# EasyEDA Pro project Pressure_Plate_PCB.eprj

# Schematic Schematic1
Board Name: V1.0; Create Date: 2025-04-03; Page Name: P1; Project Name: Pressure_Plate_PCB; Schematic Name: Schematic1; Update Date: 2025-06-12; Company: EasyEDA.com; Drawn: EasyEDA; Page Size: A4; Part Number: JLCPCB-002; Reviewed: EasyEDA; Version: V0.1
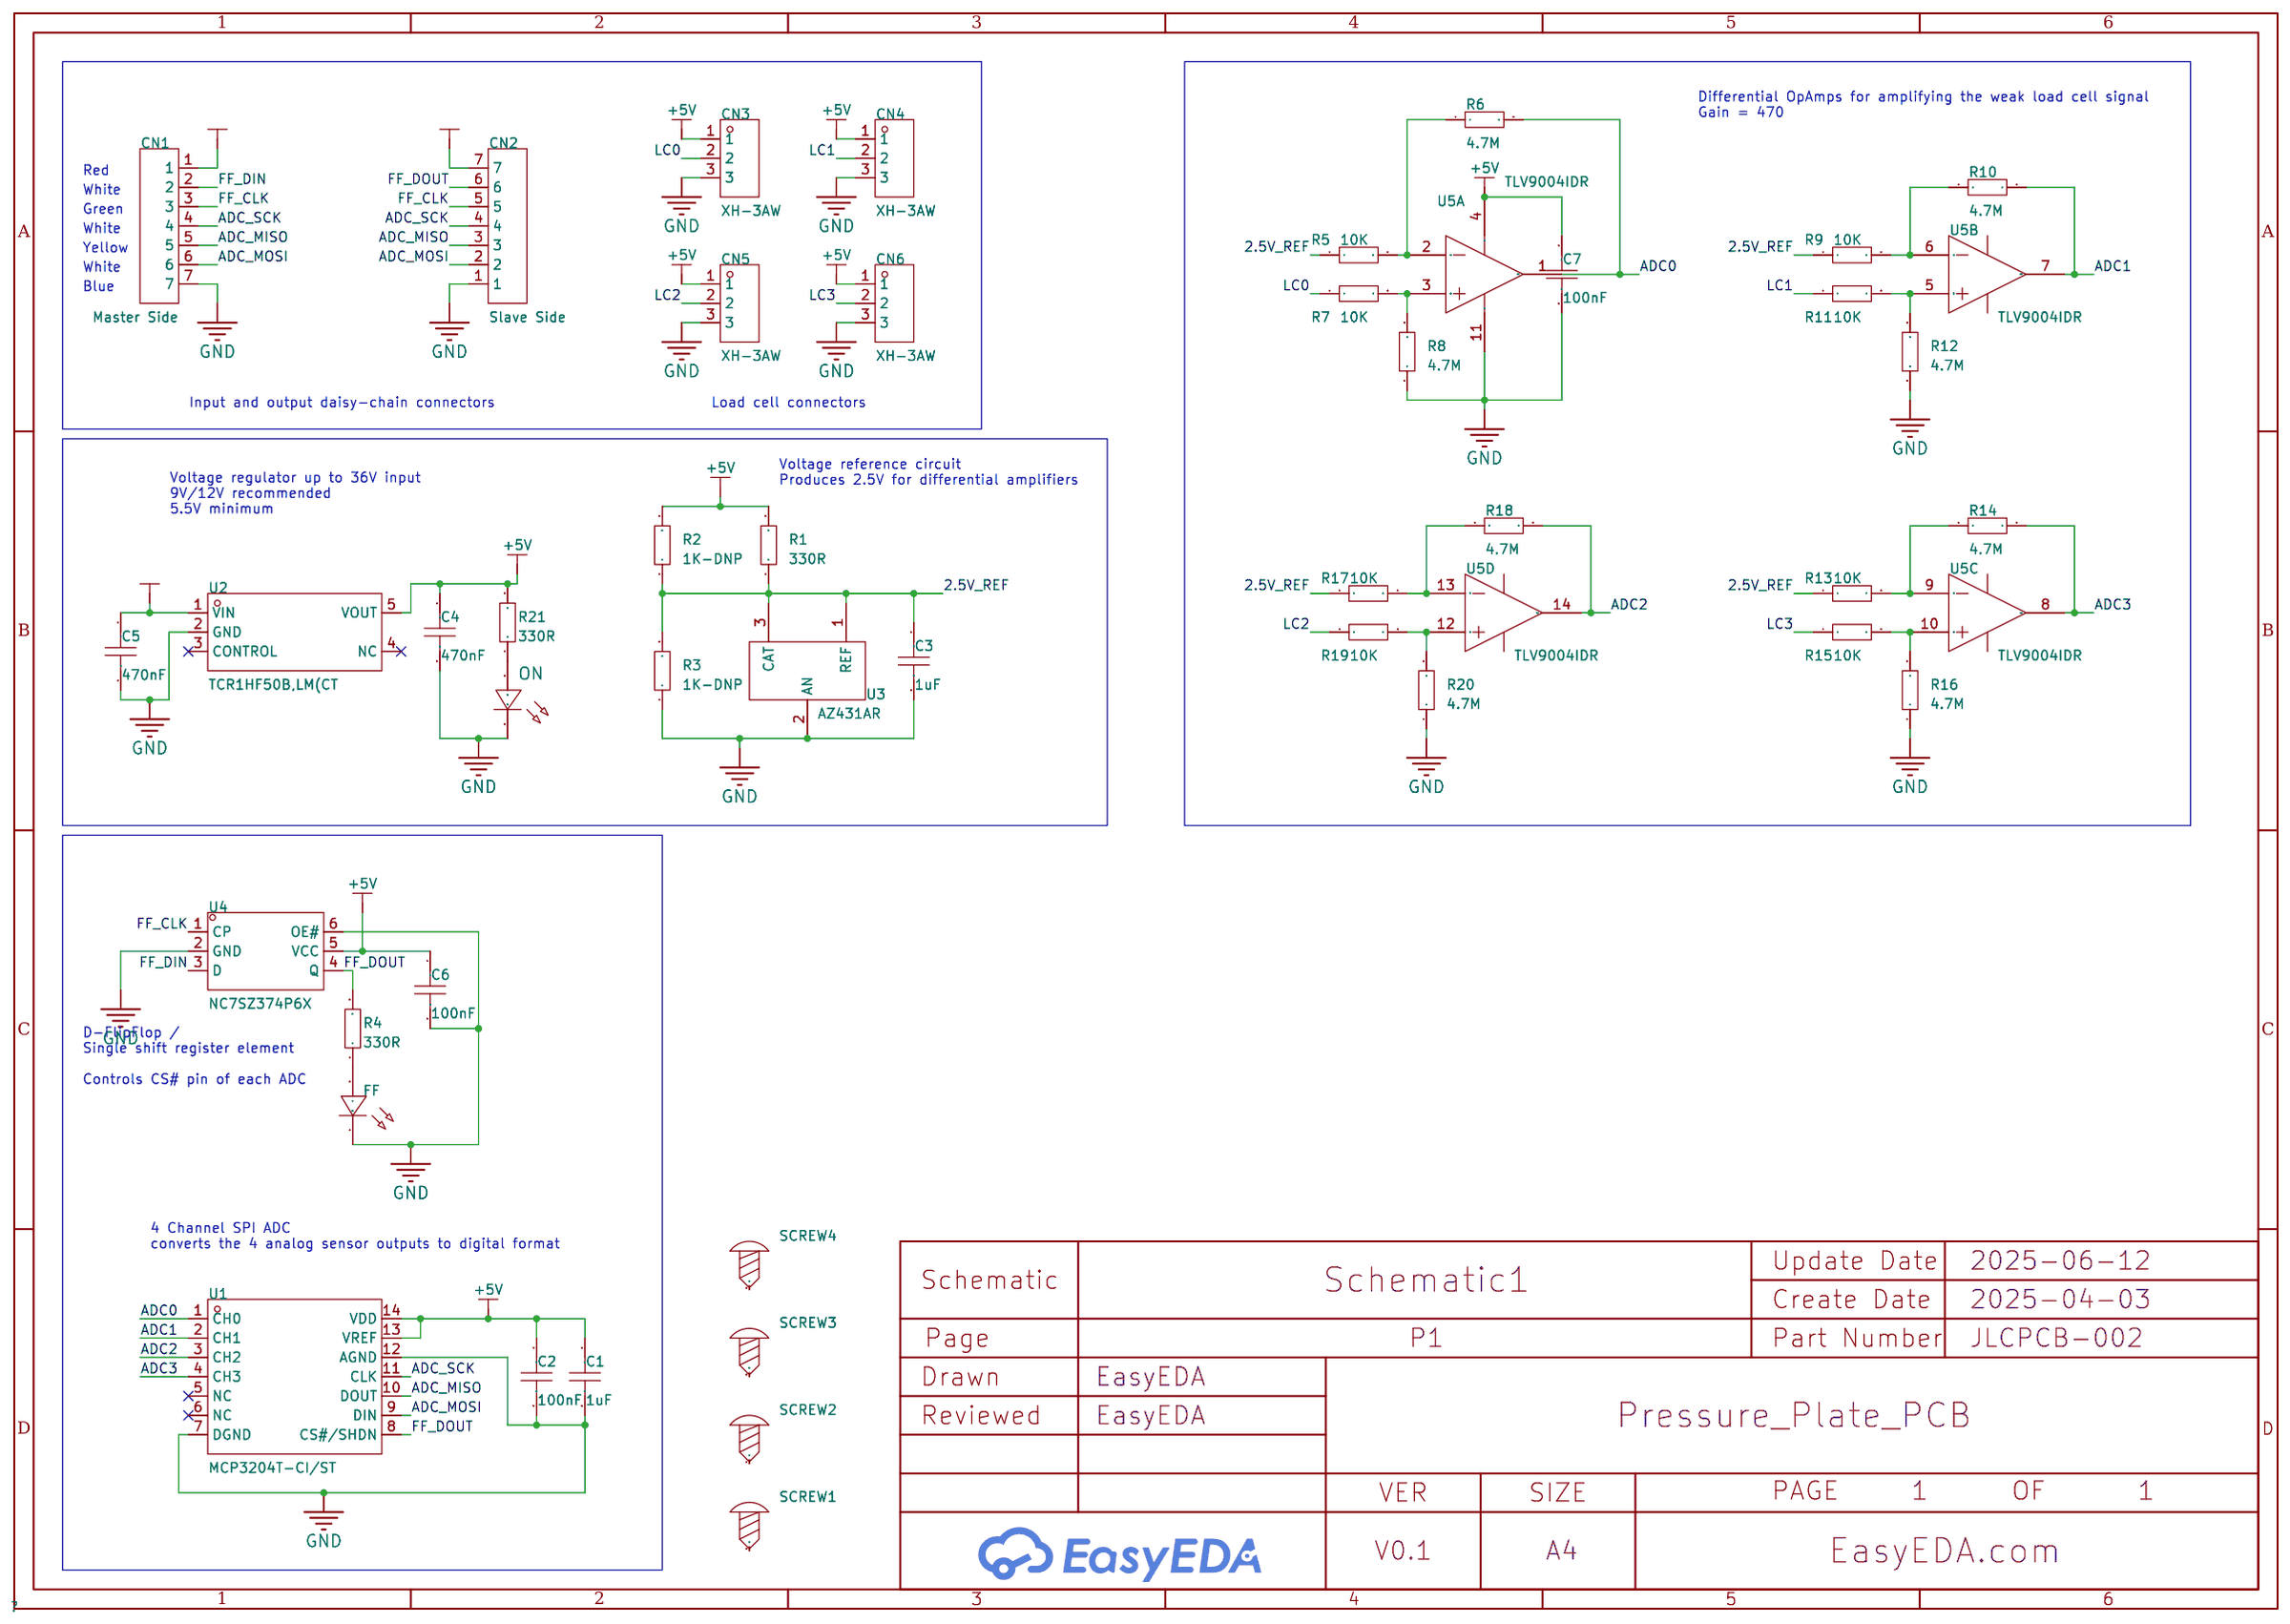
[diagram p0: schematic sheet]

## Parts
C1  1uF  [C0603]
C2  100nF  [C0603]
C3  1uF  [C0603]
C4  470nF  [C0603]
C5  470nF  [C0603]
C6  100nF  [C0603]
C7  100nF  [C0603]
CN1  Master Side  [CONN-TH_7P-P2.50_DEALON_XH-W-7A]
CN2  Slave Side  [CONN-TH_7P-P2.50_DEALON_XH-W-7A]
CN3  XH-3AW  [CONN-TH_3P-P2.50_XH-3A]
CN4  XH-3AW  [CONN-TH_3P-P2.50_XH-3A]
CN5  XH-3AW  [CONN-TH_3P-P2.50_XH-3A]
CN6  XH-3AW  [CONN-TH_3P-P2.50_XH-3A]
FF  -  [LED0603-RD_GREEN]
ON  -  [LED0603-R-RD]
R1  330R  [R0603]
R2  1K-DNP  [R0603]
R3  1K-DNP  [R0603]
R4  330R  [R0603]
R5  10K  [R0603]
R6  4.7M  [R0603]
R7  10K  [R0603]
R8  4.7M  [R0603]
R9  10K  [R0603]
R10  4.7M  [R0603]
R11  10K  [R0603]
R12  4.7M  [R0603]
R13  10K  [R0603]
R14  4.7M  [R0603]
R15  10K  [R0603]
R16  4.7M  [R0603]
R17  10K  [R0603]
R18  4.7M  [R0603]
R19  10K  [R0603]
R20  4.7M  [R0603]
R21  330R  [R0603]
SCREW1  -  [Screw-Hole-M4]
SCREW2  -  [Screw-Hole-M4]
SCREW3  -  [Screw-Hole-M4]
SCREW4  -  [Screw-Hole-M4]
U1  MCP3204T-CI/ST  [TSSOP-14_L5.0-W4.4-P0.65-LS6.4-BL]
U2  TCR1HF50B,LM(CT  [SOT-25-5_L2.9-W1.6-P0.95-LS2.8-BR]
U3  AZ431AR  [SOT-89-3_L4.5-W2.5-P1.50-LS4.2-BR]
U4  NC7SZ374P6X  [SC-70-6_L2.2-W1.3-P0.65-LS2.2-BR]
U5  TLV9004IDR  [SOIC-14_L8.7-W3.9-P1.27-LS6.0-BL]  (sections 1,2,3,4)

## Library data of the parts
C1-C7 = CAP_0603: Supplier Footprint: 0603
CN1 CN2 = XH-W-7A: LCSC Part Name: 1x7P 间距:2.5mm 弯插 系列:XH; Supplier Part: C5160924; Manufacturer: DEALON(德艺隆); Supplier Footprint: 弯插,P=2.5mm; JLCPCB Part Class: Extended Part; Datasheet: https://atta.szlcsc.com/upload/public/pdf/source/20220914/CF0CFD58EB788AE96CD22F6B3F88CF6E.pdf; Supplier: LCSC; Pins Structure: 1x7P; Pitch: 2.5mm; Mounting Type: Bend-in; Reference Series: XH; Number of Pins: 7P; Number of Rows: 1; Number of PINs Per Row: 7; Current Rating: 3A; Operating Temperature: -25℃~+85℃; Voltage Rating: 250V; Color: White
CN3-CN6 = XH-3AW_C18428: LCSC Part Name: 系列:XH 间距:2.5mm 1x3P; Supplier Part: C18428; Manufacturer: BOOMELE(博穆精密); Supplier Footprint: 弯插,P=2.5mm; JLCPCB Part Class: Extended Part; Datasheet: https://atta.szlcsc.com/upload/public/pdf/source/20151222/1457707654251.pdf; Supplier: LCSC; Pins Structure: 1x3P; Pitch: 2.5mm; Mounting Style: Right-Angle; Reference Series: XH; Number of Pins: 3P; Number of Rows: 1; Number of PINs Per Row: 3
FF = LED_0603-G
ON = LED_0603-R: Supplier Footprint: 0603
R1-R21 = Res_0603: Supplier Footprint: 0603
SCREW1-SCREW4 = Screw-Hole-M4: Supplier Footprint: 插件
U1 = MCP3204T-CI/ST: Supplier Part: C627070; Manufacturer: MICROCHIP(美国微芯); Supplier Footprint: TSSOP-14; JLCPCB Part Class: Extended Part; Datasheet: https://atta.szlcsc.com/upload/public/pdf/source/20140724/1457707162058.pdf; Supplier: LCSC; resolution: 12 Bits; sampling frequency: 100kHz; number of channels: 4; Supply Voltage: 2.7V~5.5V; Interface: SPI; differential input: Yes; Operating Temperature: -40℃~+85℃
U2 = TCR1HF50B,LM(CT: Supplier Part: C22041565; Manufacturer: TOSHIBA(东芝); Supplier: LCSC
U3 = AZ431AR-ATRE1: Supplier Part: C112173; Manufacturer: DIODES(美台); Supplier Footprint: SOT-89-3; JLCPCB Part Class: Extended Part; Datasheet: https://atta.szlcsc.com/upload/public/pdf/source/20170912/C112173_1505207743875963371.pdf; Supplier: LCSC; Output Type: Adjustable; Output Voltage: 2.5V~36V; Output Current: 100mA; Tolerance: ±0.4%; Temperature Coefficient: 20ppm/℃; Reference Type: parallel connection; Minimum Cathode Current for Regulation: 1mA; Operating Temperature: -40℃~+125℃@(Ta)
U4 = NC7SZ374P6X: Supplier Part: C232790; Manufacturer: onsemi(安森美); Supplier Footprint: SC-70-6; JLCPCB Part Class: Extended Part; Datasheet: https://atta.szlcsc.com/upload/public/pdf/source/20181222/C232790_987FEFE174370B77905B688237A9CDF8.pdf; Supplier: LCSC; Type: D-Type; Trigger Type: Rising Edge; Supply Voltage: 1.65V~5.5V; Clock Frequency: 175MHz; Function: Standard; Number of Elements: 1; Number of Bits per Element: 1; Maximum Propagation Delay: 4ns@5V,50pF; Series: 7SZSeries; Sink Current: 32mA; Source Current: 32mA; Quiescent Current (Iq): 1uA; Input Capacitance: 3pF; Operating Temperature: -40℃~+85℃
U5 = TLV9004IDR: Supplier Part: C2058000; Manufacturer: TI(德州仪器); Supplier Footprint: SOIC-14; JLCPCB Part Class: Extended Part; Datasheet: https://www.ti.com/cn/lit/gpn/tlv9004; Supplier: LCSC; Number of Circuits: Four channels; Gain Bandwidth Product(GBP): 1MHz; Slew Rate(SR): 2V/us; Current - Input Bias(Ib): 5pA; Output Current: 40mA; Operating Temperature: -40℃~+125℃

## Nets
2.5V_REF: C3.1 R1.1 R2.1 R3.2 R5.1 R9.1 R13.1 R17.1 U3.1(REF) U3.3(CAT)
+5V: C1.1 C2.1 C4.1 C6.1 C7.1 CN3.1 CN4.1 CN5.1 CN6.1 R1.2 R2.2 R21.2 U1.13(VREF) U1.14(VDD) U2.5(VOUT) U4.5(VCC) U5.4(V+)
GND: C1.2 C2.2 C3.2 C4.2 C5.2 C6.2 C7.2 CN1.7 CN2.1 CN3.3 CN4.3 CN5.3 CN6.3 FF.1(C) ON.2(C) R3.1 R8.1 R12.1 R16.1 R20.1 U1.7(DGND) U1.12(AGND) U2.2(GND) U3.2(AN) U4.2(GND) U4.6(OE#) U5.11(V-)
VCC: C5.1 CN1.1 CN2.7 U2.1(VIN)
ADC0: R6.2 U1.1(CH0) U5.1(OUT1)
ADC1: R10.2 U1.2(CH1) U5.7(OUT2)
ADC2: R18.2 U1.3(CH2) U5.14(OUT4)
ADC3: R14.2 U1.4(CH3) U5.8(OUT3)
ADC_MISO: CN1.5 CN2.3 U1.10(DOUT)
ADC_MOSI: CN1.6 CN2.2 U1.9(DIN)
ADC_SCK: CN1.4 CN2.4 U1.11(CLK)
FF_CLK: CN1.3 CN2.5 U4.1(CP)
FF_DIN: CN1.2 U4.3(D)
FF_DOUT: CN2.6 R4.2 U1.8(CS#/SHDN) U4.4(Q)
LC0: CN3.2 R7.1
LC1: CN4.2 R11.1
LC2: CN5.2 R19.1
LC3: CN6.2 R15.1
$1N2374: FF.2(A) R4.1
$1N2890: R7.2 R8.2 U5.3(IN1+)
$1N2902: R5.2 R6.1 U5.2(IN1-)
$1N3068: R11.2 R12.2 U5.5(IN2+)
$1N3071: R9.2 R10.1 U5.6(IN2-)
$1N3198: R15.2 R16.2 U5.10(IN3+)
$1N3201: R13.2 R14.1 U5.9(IN3-)
$1N3455: R19.2 R20.2 U5.12(IN4+)
$1N3458: R17.2 R18.1 U5.13(IN4-)
$1N3772: ON.1(A) R21.1

Not connected (* = marked no-connect by the designer): SCREW1 1; SCREW2 1; SCREW3 1; SCREW4 1; U1 5(NC)* 6(NC)*; U2 3(CONTROL)* 4(NC)*

## Notes on the sheet
- Differential OpAmps for amplifying the weak load cell signal
  Gain = 470
- Red
- White
- Green
- White
- White
- Yellow
- Blue
- Input and output daisy-chain connectors
- Load cell connectors
- Voltage reference circuit
  Produces 2.5V for differential amplifiers
- Voltage regulator up to 36V input
  9V/12V recommended
  5.5V minimum
- D-FlipFlop /
  Single shift register element
  Controls CS# pin of each ADC
- 4 Channel SPI ADC
  converts the 4 analog sensor outputs to digital format

# Schematic Schematic1_1
Board Name: V1.0_SOIC14; Create Date: 2025-05-13; Page Name: P1; Project Name: Pressure_Plate_PCB; Schematic Name: Schematic1_1; Update Date: 2025-05-13; Company: EasyEDA.com; Drawn: EasyEDA; Page Size: A4; Part Number: JLCPCB-002; Reviewed: EasyEDA; Version: V0.1
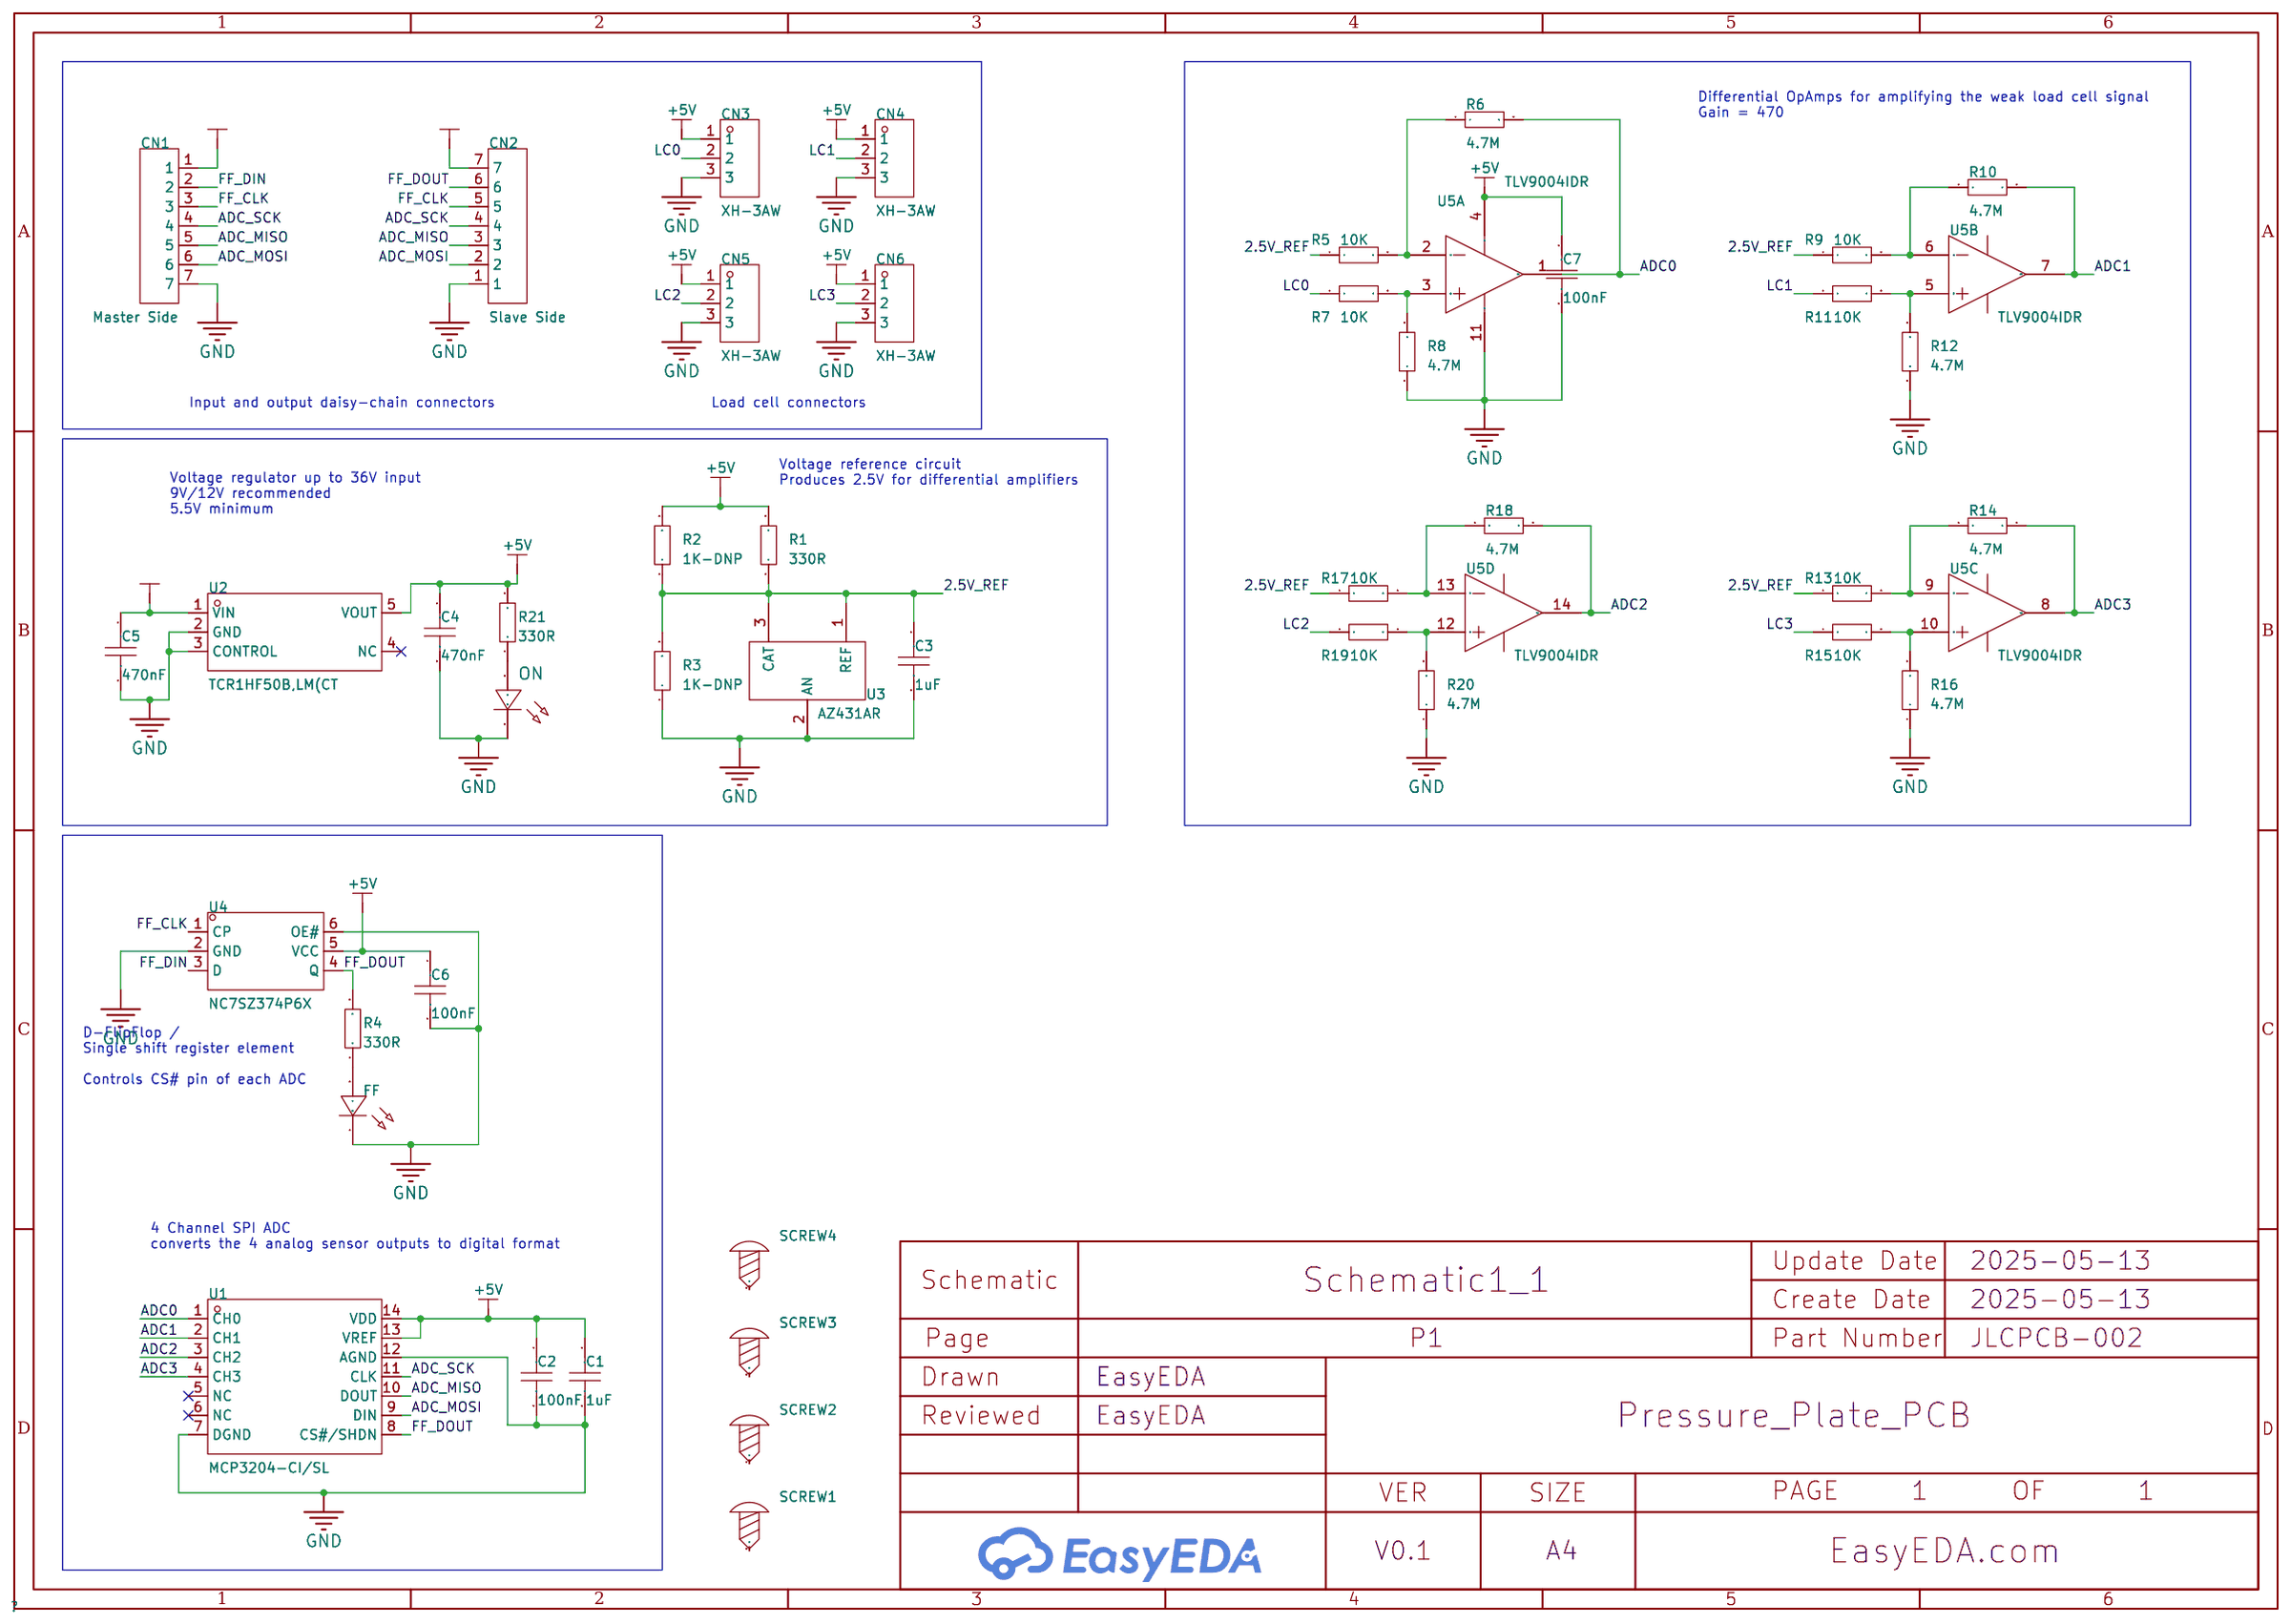
[diagram p1: schematic sheet]

## Parts
C1  1uF  [C0603]
C2  100nF  [C0603]
C3  1uF  [C0603]
C4  470nF  [C0603]
C5  470nF  [C0603]
C6  100nF  [C0603]
C7  100nF  [C0603]
CN1  Master Side  [CONN-TH_7P-P2.50_DEALON_XH-W-7A]
CN2  Slave Side  [CONN-TH_7P-P2.50_DEALON_XH-W-7A]
CN3  XH-3AW  [CONN-TH_3P-P2.50_XH-3A]
CN4  XH-3AW  [CONN-TH_3P-P2.50_XH-3A]
CN5  XH-3AW  [CONN-TH_3P-P2.50_XH-3A]
CN6  XH-3AW  [CONN-TH_3P-P2.50_XH-3A]
FF  -  [LED0603-RD_GREEN]
ON  -  [LED0603-R-RD]
R1  330R  [R0603]
R2  1K-DNP  [R0603]
R3  1K-DNP  [R0603]
R4  330R  [R0603]
R5  10K  [R0603]
R6  4.7M  [R0603]
R7  10K  [R0603]
R8  4.7M  [R0603]
R9  10K  [R0603]
R10  4.7M  [R0603]
R11  10K  [R0603]
R12  4.7M  [R0603]
R13  10K  [R0603]
R14  4.7M  [R0603]
R15  10K  [R0603]
R16  4.7M  [R0603]
R17  10K  [R0603]
R18  4.7M  [R0603]
R19  10K  [R0603]
R20  4.7M  [R0603]
R21  330R  [R0603]
SCREW1  -  [Screw-Hole-M4]
SCREW2  -  [Screw-Hole-M4]
SCREW3  -  [Screw-Hole-M4]
SCREW4  -  [Screw-Hole-M4]
U1  MCP3204-CI/SL  [SOIC-14_L8.7-W3.9-P1.27-LS6.0-BL]
U2  TCR1HF50B,LM(CT  [SOT-25-5_L2.9-W1.6-P0.95-LS2.8-BR]
U3  AZ431AR  [SOT-89-3_L4.5-W2.5-P1.50-LS4.2-BR]
U4  NC7SZ374P6X  [SC-70-6_L2.2-W1.3-P0.65-LS2.2-BR]
U5  TLV9004IDR  [SOIC-14_L8.7-W3.9-P1.27-LS6.0-BL]  (sections 1,2,3,4)

## Library data of the parts
C1-C7 = CAP_0603: Supplier Footprint: 0603
CN1 CN2 = XH-W-7A: LCSC Part Name: 1x7P 间距:2.5mm 弯插 系列:XH; Supplier Part: C5160924; Manufacturer: DEALON(德艺隆); Supplier Footprint: 弯插,P=2.5mm; JLCPCB Part Class: Extended Part; Datasheet: https://atta.szlcsc.com/upload/public/pdf/source/20220914/CF0CFD58EB788AE96CD22F6B3F88CF6E.pdf; Supplier: LCSC; Pins Structure: 1x7P; Pitch: 2.5mm; Mounting Type: Bend-in; Reference Series: XH; Number of Pins: 7P; Number of Rows: 1; Number of PINs Per Row: 7; Current Rating: 3A; Operating Temperature: -25℃~+85℃; Voltage Rating: 250V; Color: White
CN3-CN6 = XH-3AW_C18428: LCSC Part Name: 系列:XH 间距:2.5mm 1x3P; Supplier Part: C18428; Manufacturer: BOOMELE(博穆精密); Supplier Footprint: 弯插,P=2.5mm; JLCPCB Part Class: Extended Part; Datasheet: https://atta.szlcsc.com/upload/public/pdf/source/20151222/1457707654251.pdf; Supplier: LCSC; Pins Structure: 1x3P; Pitch: 2.5mm; Mounting Style: Right-Angle; Reference Series: XH; Number of Pins: 3P; Number of Rows: 1; Number of PINs Per Row: 3
FF = LED_0603-G
ON = LED_0603-R: Supplier Footprint: 0603
R1-R21 = Res_0603: Supplier Footprint: 0603
SCREW1-SCREW4 = Screw-Hole-M4: Supplier Footprint: 插件
U1 = MCP3204-CI/SL: Supplier Part: C32816; Manufacturer: MICROCHIP(美国微芯); Supplier Footprint: SOIC-14; JLCPCB Part Class: Extended Part; Datasheet: https://atta.szlcsc.com/upload/public/pdf/source/20140724/1457707162058.pdf; Supplier: LCSC; Resolution(Bits): 12Bit; Sampling Rate: 100kHz; number of channels: 4; Voltage - Supply: 2.7V~5.5V; Interface: SPI；serial; Integral non - linearity: 2LSB; Operating Temperature: -40℃~+85℃
U2 = TCR1HF50B,LM(CT: Supplier Part: C22041565; Manufacturer: TOSHIBA(东芝); Supplier: LCSC
U3 = AZ431AR-ATRE1: Supplier Part: C112173; Manufacturer: DIODES(美台); Supplier Footprint: SOT-89-3; JLCPCB Part Class: Extended Part; Datasheet: https://atta.szlcsc.com/upload/public/pdf/source/20170912/C112173_1505207743875963371.pdf; Supplier: LCSC; Output Type: Adjustable; Output Voltage: 2.5V~36V; Output Current: 100mA; Tolerance: ±0.4%; Temperature Coefficient: 20ppm/℃; Reference Type: parallel connection; Minimum Cathode Current for Regulation: 1mA; Operating Temperature: -40℃~+125℃@(Ta)
U4 = NC7SZ374P6X: Supplier Part: C232790; Manufacturer: onsemi(安森美); Supplier Footprint: SC-70-6; JLCPCB Part Class: Extended Part; Datasheet: https://atta.szlcsc.com/upload/public/pdf/source/20181222/C232790_987FEFE174370B77905B688237A9CDF8.pdf; Supplier: LCSC; Type: D-Type; Trigger Type: Rising Edge; Supply Voltage: 1.65V~5.5V; Clock Frequency: 175MHz; Function: Standard; Number of Elements: 1; Number of Bits per Element: 1; Maximum Propagation Delay: 4ns@5V,50pF; Series: 7SZSeries; Sink Current: 32mA; Source Current: 32mA; Quiescent Current (Iq): 1uA; Input Capacitance: 3pF; Operating Temperature: -40℃~+85℃
U5 = TLV9004IDR: Supplier Part: C2058000; Manufacturer: TI(德州仪器); Supplier Footprint: SOIC-14; JLCPCB Part Class: Extended Part; Datasheet: https://www.ti.com/cn/lit/gpn/tlv9004; Supplier: LCSC; Number of Circuits: Four channels; Gain Bandwidth Product(GBP): 1MHz; Slew Rate(SR): 2V/us; Current - Input Bias(Ib): 5pA; Output Current: 40mA; Operating Temperature: -40℃~+125℃

## Nets
2.5V_REF: C3.1 R1.1 R2.1 R3.2 R5.1 R9.1 R13.1 R17.1 U3.1(REF) U3.3(CAT)
+5V: C1.1 C2.1 C4.1 C6.1 C7.1 CN3.1 CN4.1 CN5.1 CN6.1 R1.2 R2.2 R21.2 U1.13(VREF) U1.14(VDD) U2.5(VOUT) U4.5(VCC) U5.4(V+)
GND: C1.2 C2.2 C3.2 C4.2 C5.2 C6.2 C7.2 CN1.7 CN2.1 CN3.3 CN4.3 CN5.3 CN6.3 FF.1(C) ON.2(C) R3.1 R8.1 R12.1 R16.1 R20.1 U1.7(DGND) U1.12(AGND) U2.2(GND) U2.3(CONTROL) U3.2(AN) U4.2(GND) U4.6(OE#) U5.11(V-)
VCC: C5.1 CN1.1 CN2.7 U2.1(VIN)
ADC0: R6.2 U1.1(CH0) U5.1(OUT1)
ADC1: R10.2 U1.2(CH1) U5.7(OUT2)
ADC2: R18.2 U1.3(CH2) U5.14(OUT4)
ADC3: R14.2 U1.4(CH3) U5.8(OUT3)
ADC_MISO: CN1.5 CN2.3 U1.10(DOUT)
ADC_MOSI: CN1.6 CN2.2 U1.9(DIN)
ADC_SCK: CN1.4 CN2.4 U1.11(CLK)
FF_CLK: CN1.3 CN2.5 U4.1(CP)
FF_DIN: CN1.2 U4.3(D)
FF_DOUT: CN2.6 R4.2 U1.8(CS#/SHDN) U4.4(Q)
LC0: CN3.2 R7.1
LC1: CN4.2 R11.1
LC2: CN5.2 R19.1
LC3: CN6.2 R15.1
$1N2374: FF.2(A) R4.1
$1N2890: R7.2 R8.2 U5.3(IN1+)
$1N2902: R5.2 R6.1 U5.2(IN1-)
$1N3068: R11.2 R12.2 U5.5(IN2+)
$1N3071: R9.2 R10.1 U5.6(IN2-)
$1N3198: R15.2 R16.2 U5.10(IN3+)
$1N3201: R13.2 R14.1 U5.9(IN3-)
$1N3455: R19.2 R20.2 U5.12(IN4+)
$1N3458: R17.2 R18.1 U5.13(IN4-)
$1N3772: ON.1(A) R21.1

Not connected (* = marked no-connect by the designer): SCREW1 1; SCREW2 1; SCREW3 1; SCREW4 1; U1 5(NC)* 6(NC)*; U2 4(NC)*

## Notes on the sheet
- Differential OpAmps for amplifying the weak load cell signal
  Gain = 470
- Input and output daisy-chain connectors
- Load cell connectors
- Voltage reference circuit
  Produces 2.5V for differential amplifiers
- Voltage regulator up to 36V input
  9V/12V recommended
  5.5V minimum
- D-FlipFlop /
  Single shift register element
  Controls CS# pin of each ADC
- 4 Channel SPI ADC
  converts the 4 analog sensor outputs to digital format

# Board PCB1
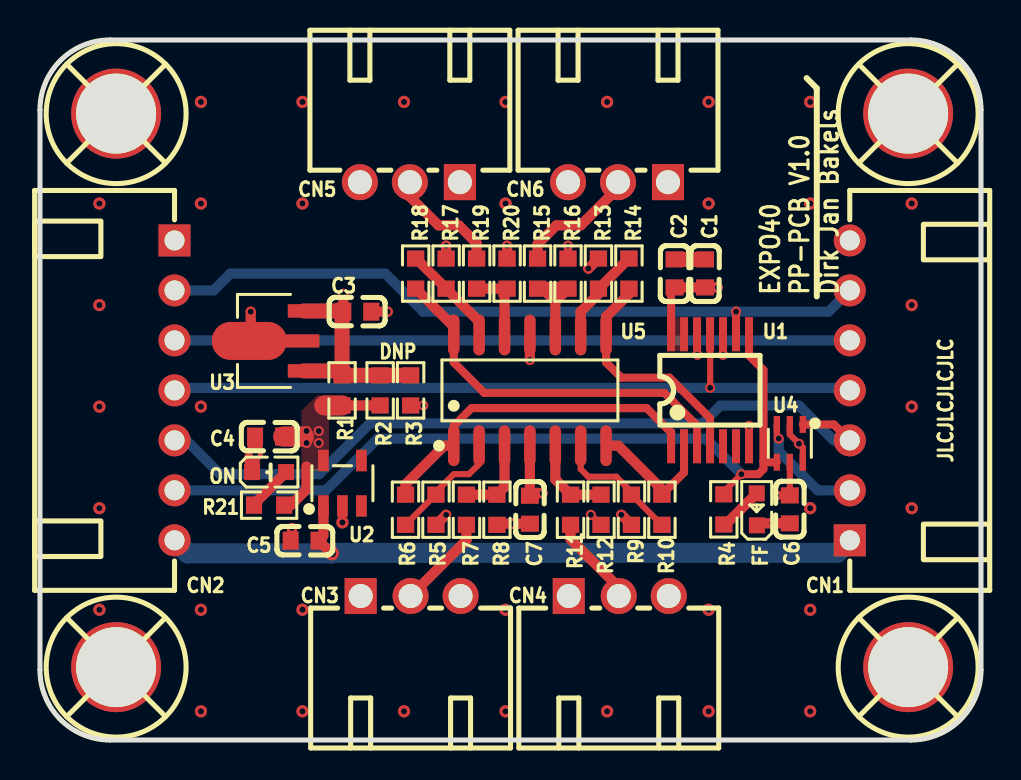
[diagram p2: board, top side]
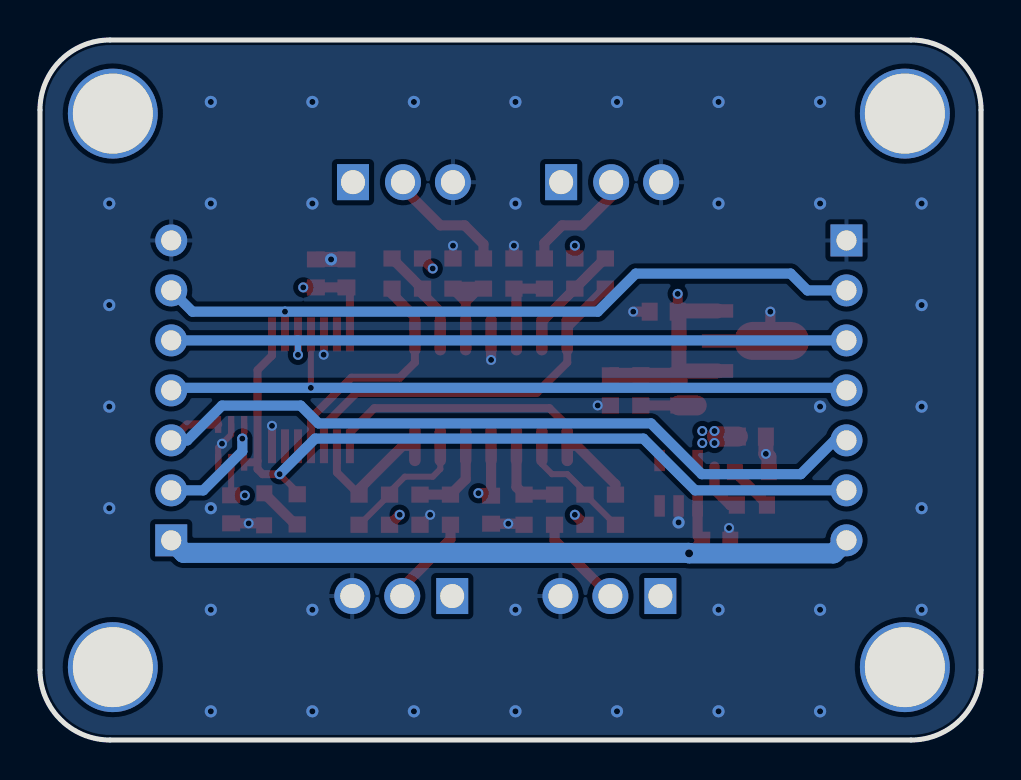
[diagram p3: board, bottom side, seen from below]

Outline 47.08 x 35.01 mm; copper layers: Top Layer, Gnd, PWR, Bottom Layer. Coordinates in mm from the lower left corner of the outline.
Outline path: 0,31.51 0,3.5 arc(1.03,1.03) 3.5,0 43.58,0 arc(46.05,1.03) 47.08,3.5 47.08,31.51 arc(46.05,33.99) 43.58,35.01 3.5,35.01 arc(1.03,33.99) 0,31.51
Stack: Top Layer 0.035mm Outer layer thickness 1oz / Dielectric1 0.2104mm 7628 RC49% 8.6mil / Gnd 0.0152mm Inner layer thickness / Dielectric2 1.065mm 1.1mm H/HOZ Copper / PWR 0.0152mm Inner layer thickness / Dielectric3 0.2104mm 7628 RC49% 8.6mil / Bottom Layer 0.035mm Outer layer thickness 1oz

## Design rules (mm)
template: JLCPCB Capability(Multiple Layers Board)
spacing copperThickness1oz (default): track to track 0.102, other pairs 0.152 to 0.3
spacing copperThickness2oz: track to track 0.203, other pairs 0.152 to 0.3
spacing copperThicknessInner0.5oz: track to track 0.089, other pairs 0.152 to 0.3
track width copperThickness1oz (default): min 0.102, default 0.254, max 2.54
track width copperThickness2oz: min 0.203, default 0.254, max 2.54
track width copperThickness0.5oz: min 0.089, default 0.254, max 2.54
differential pair differentialPair (default): width min 0.127, default 0.254, max 2.54; gap min 0.152, default 0.152
via viaSize (default): diameter min 0.3, default 0.61, max 10; hole min 0.2, default 0.305, max 6.3

## Placement (name value [footprint] x y rotation side)
C1  1uF  [C0603]  33.27 23.34 90 top
C2  100nF  [C0603]  31.75 23.34 90 top
C3  1uF  [C0603]  15.88 21.42 0 top
C4  470nF  [C0603]  11.46 15.18 180 top
C5  470nF  [C0603]  13.24 9.97 180 top
C6  100nF  [C0603]  37.51 11.54 270 top
C7  100nF  [C0603]  24.51 11.52 270 top
CN1  Master Side  [CONN-TH_7P-P2.50_DEALON_XH-W-7A]  40.51 17.49 90 top
CN2  Slave Side  [CONN-TH_7P-P2.50_DEALON_XH-W-7A]  6.73 17.49 270 top
CN3  XH-3AW  [CONN-TH_3P-P2.50_XH-3A]  18.54 7.2 0 top
CN4  XH-3AW  [CONN-TH_3P-P2.50_XH-3A]  28.96 7.2 0 top
CN5  XH-3AW  [CONN-TH_3P-P2.50_XH-3A]  18.5 27.9 180 top
CN6  XH-3AW  [CONN-TH_3P-P2.50_XH-3A]  28.92 27.9 180 top
FF  -  [LED0603-RD_GREEN]  35.86 11.54 90 top
ON  -  [LED0603-R-RD]  11.46 13.4 0 top
R1  330R  [R0603]  15.11 17.49 270 top
R2  1K-DNP  [R0603]  17.02 17.49 270 top
R3  1K-DNP  [R0603]  18.54 17.49 90 top
R4  330R  [R0603]  34.21 11.54 90 top
R5  10K  [R0603]  19.81 11.52 90 top
R6  4.7M  [R0603]  18.29 11.52 90 top
R7  10K  [R0603]  21.34 11.52 90 top
R8  4.7M  [R0603]  22.86 11.52 90 top
R9  10K  [R0603]  29.59 11.52 90 top
R10  4.7M  [R0603]  31.12 11.52 90 top
R11  10K  [R0603]  26.54 11.52 90 top
R12  4.7M  [R0603]  28.07 11.52 90 top
R13  10K  [R0603]  27.94 23.33 270 top
R14  4.7M  [R0603]  29.46 23.33 270 top
R15  10K  [R0603]  24.89 23.33 270 top
R16  4.7M  [R0603]  26.42 23.33 270 top
R17  10K  [R0603]  20.32 23.33 270 top
R18  4.7M  [R0603]  18.8 23.33 270 top
R19  10K  [R0603]  21.84 23.33 270 top
R20  4.7M  [R0603]  23.37 23.33 270 top
R21  330R  [R0603]  11.46 11.75 0 top
SCREW1  -  [Screw-Hole-M4]  43.43 3.64 0 top
SCREW2  -  [Screw-Hole-M4]  3.81 3.64 0 top
SCREW3  -  [Screw-Hole-M4]  3.81 31.33 0 top
SCREW4  -  [Screw-Hole-M4]  43.43 31.33 0 top
U1  MCP3204T-CI/ST  [TSSOP-14_L5.0-W4.4-P0.65-LS6.4-BL]  33.52 17.49 0 top
U2  TCR1HF50B,LM(CT  [SOT-25-5_L2.9-W1.6-P0.95-LS2.8-BR]  15.13 12.84 270 top
U3  AZ431AR  [SOT-89-3_L4.5-W2.5-P1.50-LS4.2-BR]  11.83 19.96 0 top
U4  NC7SZ374P6X  [SC-70-6_L2.2-W1.3-P0.65-LS2.2-BR]  37.51 14.84 90 top
U5  TLV9004IDR  [SOIC-14_L8.7-W3.9-P1.27-LS6.0-BL]  24.51 17.49 0 top

## Footprints (pads in the part's own frame, mm; a bottom-side part is the same pattern mirrored in y, then rotated)
C0603
  rect 0.8x0.9 smd: 1(-0.7,0) 2(0.7,0)
CONN-TH_3P-P2.50_XH-3A
  rect 1.6x1.8 hole 1.2: 1(-2.5,0)
  round 1.8 hole 1.2: 2(0,0) 3(2.5,0)
CONN-TH_7P-P2.50_DEALON_XH-W-7A
  rect 1.6x1.6 hole 1: 1(-7.5,0)
  round 1.6 hole 1: 2(-5,0) 3(-2.5,0) 4(0,0) 5(2.5,0) 6(5,0) 7(7.5,0)
LED0603-R-RD
  rect 0.8x0.8 smd: 1(0.851,0) 2(-0.851,0)
LED0603-RD_GREEN
  rect 0.8x0.8 smd: 1(-0.799,-0.004) 2(0.799,0.004)
R0603
  rect 0.806x0.864 smd: 1(-0.753,0) 2(0.753,0)
SC-70-6_L2.2-W1.3-P0.65-LS2.2-BR
  rect 0.841x0.315 smd: 1(0.946,-0.65) 2(0.946,0) 3(0.946,0.65) 4(-0.946,0.65) 5(-0.946,0) 6(-0.946,-0.65)
Screw-Hole-M4
  round 4.5 hole 4: 1(0,0)
SOIC-14_L8.7-W3.9-P1.27-LS6.0-BL
  oval 0.574x2.038 smd: 1(-3.81,-2.769) 2(-2.54,-2.769) 3(-1.27,-2.769) 4(0,-2.769) 5(1.27,-2.769) 6(2.54,-2.769) 7(3.81,-2.769) 8(3.81,2.769) 9(2.54,2.769) 10(1.27,2.769) 11(0,2.769) 12(-1.27,2.769) 13(-2.54,2.769) 14(-3.81,2.769)
SOT-25-5_L2.9-W1.6-P0.95-LS2.8-BR
  rect 1.07x0.532 smd: 1(1.135,-0.95) 2(1.135,0) 3(1.135,0.95) 4(-1.135,0.95) 5(-1.135,-0.95)
SOT-89-3_L4.5-W2.5-P1.50-LS4.2-BR
  rect 1.575x0.672 smd: 1(1.356,-1.5) 3(1.356,1.5)
  custom 5.377x1.9 smd: 2(-1.356,0)
TSSOP-14_L5.0-W4.4-P0.65-LS6.4-BL
  rect 0.4x1.7 smd: 1(-1.95,-2.8) 2(-1.3,-2.8) 3(-0.65,-2.8) 4(0,-2.8) 5(0.65,-2.8) 6(1.3,-2.8) 7(1.95,-2.8) 8(1.95,2.8) 9(1.3,2.8) 10(0.65,2.8) 11(0,2.8) 12(-0.65,2.8) 13(-1.3,2.8) 14(-1.95,2.8)

## Nets
As in the schematic.

Pads without a net: SCREW1 1; SCREW2 1; SCREW3 1; SCREW4 1; U1 5 6; U2 3 4

## Via types
v1: diameter 0.61, hole 0.305, Top Layer to Bottom Layer, 37 vias
v2: diameter 0.5, hole 0.3, Top Layer to Bottom Layer, 31 vias
v3: diameter 0.7, hole 0.4, Top Layer to Bottom Layer, 1 via

## Routing (per net, layer and track width the routed paths; a pad name or vN(x,y) marks a point on that pad's centre or on a via; arc(x,y) is an arc through that point)
2.5V_REF: length 52.7
  Top Layer w0.508: v2(20.32,24.73) R17.1 ; v2(27.43,23.58) 27.44,23.58 R13.1 ; R5.1 20.31,11.27 v2(20.32,11.27) ; v2(29.08,11.27) 29.09,11.27 R9.1 ; C3.1 v2(15.17,22.31)
  Top Layer w0.75: R1.1 R2.1 R3.2 ; R1.1 14.89,18.46 U3.1 ; R1.1 15.11,21.36 C3.1 15.14,21.46 U3.3
  PWR w0.508: v2(27.43,23.58) 21.46,23.58 v2(20.32,24.73) 17.59,24.73 v2(15.17,22.31) 15.17,14.63 18.54,11.27 v2(20.32,11.27) 22.35,13.3 27.05,13.3 v2(29.08,11.27)
+5V: length 16.5
  Top Layer w0.305: U4.5 C6.1
  Top Layer w0.4: C2.1 31.57,22.46 U1.14 ; C6.1 v2(36.83,12.24)
  Top Layer w0.508: C2.1 C1.1 v2(33.91,22.64) ; v2(25.15,12.35) 24.64,12.35 C7.1 U5.4 ; R1.2 R2.2 ; 13.34,13.68 13.34,12.53 12.55,11.75 R21.2
  Top Layer w1.001: C4.1 13.21,15.18 ; R1.2 14.22,16.73
  vias: v2(13.34,15.46) v2(13.34,14.86) v2(13.94,15.46) v2(13.94,14.86)
GND: length 18.6
  Top Layer w0.305: R12.1 27.57,11.27 v2(27.56,11.27) ; v2(32.89,19.27) 32.87,19.29 U1.12 ; U1.7 v2(35.47,15.72) ; R3.1 v2(19.18,16.73) ; U4.6 38.16,14.63 v2(37.97,14.82) 37.51,15.28 U4.2
  Top Layer w0.4: R16.1 v2(26.42,24.73) ; U2.2 v1(15.13,10.88)
  Top Layer w0.508: U3.2 10.54,20.03 v2(10.54,21.42) ; R20.1 v2(23.37,24.73) ; C7.2 v2(23.65,10.82) 22.91,10.82 R8.1 ; v2(12.61,10.61) 12.61,10.04 C5.2 ; U5.11 v2(24.51,19.01) ; FF.1 35.97,10.84 v2(36.64,10.84) C6.2 ; C3.2 v2(17.4,21.42)
  Top Layer w0.75: C4.2 v2(10.76,14.31) 10.61,14.16 ON.2 ; C1.2 v1(32.52,24.04) C2.2
  vias: v1(2.97,26.83) v1(2.97,21.75) v1(2.97,16.67) v1(2.97,11.59) v1(2.97,6.52) v1(8.05,31.91) v1(8.05,26.83) v1(8.05,16.67) v1(8.05,6.52) v1(8.05,1.43) v1(13.13,31.91) v1(13.13,26.83) v1(13.13,6.52) v1(13.13,1.43) v1(18.21,31.91) v1(18.21,1.43) v1(23.29,31.91) v1(23.29,26.83) v1(23.29,6.52) v1(23.29,1.43) v1(28.37,31.91) v1(28.37,1.43) v1(33.45,31.91) v1(33.45,26.83) v1(33.45,6.52) v1(33.45,1.43) v1(38.53,31.91) v1(38.53,26.83) v1(38.53,11.59) v1(38.53,6.52) v1(38.53,1.43) v1(43.61,26.83) v1(43.61,21.75) v1(43.61,16.67) v1(43.61,11.59)
VCC: length 36.7
  Top Layer w0.508: C5.1 14.58,9.34 v3(14.6,9.34) ; U2.1 14.18,10.21
  Bottom Layer w1.001: CN2.7 7.38,9.34 v3(14.6,9.34) 14.63,9.36 39.88,9.36 CN1.1
ADC0: length 17.2
  Top Layer w0.4: U1.1 31.57,15.38 30.35,16.6 21.59,16.6 20.7,15.71 U5.1
  Top Layer w0.508: R6.2 18.29,12.79 20.22,14.72 U5.1
ADC1: length 6.8
  Top Layer w0.4: U1.2 32.22,13.38 R10.2
  Top Layer w0.508: R10.2 31.12,12.53 28.93,14.72 U5.7
ADC2: length 19
  Top Layer w0.4: U1.3 32.87,15.73 31.24,17.36 22.22,17.36 20.7,18.88 U5.14
  Top Layer w0.508: R18.2 20.7,20.67 U5.14
ADC3: length 11.9
  Top Layer w0.4: U5.8 28.32,18.88 29.08,18.12 31.5,18.12 33.52,16.1 U1.4
  Top Layer w0.508: U5.8 28.32,21.17 29.46,22.31 R14.2
ADC_MISO: length 35.5
  Top Layer w0.4: U1.10 v2(34.17,19.27)
  Bottom Layer w0.305: v2(34.17,19.27) 34.17,19.98 34.18,19.99
  Bottom Layer w0.508: CN1.5 CN2.3
ADC_MOSI: length 36.5
  Top Layer w0.4: 34.82,20.29 v2(34.82,21.42)
  Bottom Layer w0.508: CN1.6 39.45,21.42 v2(34.82,21.42) 19.18,21.42 17.27,23.33 9.53,23.33 8.68,22.49 CN2.2
ADC_SCK: length 36.6
  Top Layer w0.305: v2(33.53,17.61) 33.53,20.29 U1.11
  Bottom Layer w0.508: CN1.4 40.39,17.61 v2(33.53,17.61) 6.86,17.61 CN2.4
FF_CLK: length 39.3
  Top Layer w0.4: U4.1 39.72,15.78 CN1.3
  Bottom Layer w0.508: CN2.5 7.33,14.99 9.02,13.3 13.97,13.3 16.51,15.84 33.15,15.84 34.04,16.73 37.97,16.73 39.71,14.99 CN1.3
FF_DIN: length 5.7
  Top Layer w0.305: v2(36.96,15.07) 36.86,15.17 U4.3
  Bottom Layer w0.508: v2(36.96,15.07) 36.96,14.44 38.91,12.49 CN1.2
FF_DOUT: length 40.5
  Top Layer w0.305: v2(35.09,13.3) 34.21,12.42 34.21,12.29
  Top Layer w0.4: 36.19,13.95 36.19,18.5 35.47,19.23 U1.8 ; 36.19,13.95 36.25,13.89 U4.4 ; 36.19,13.95 36.19,13.55 35.94,13.3 v2(35.09,13.3)
  Bottom Layer w0.508: v2(35.09,13.3) 33.31,15.07 16.89,15.07 14.3,12.49 CN2.6
LC0: length 4.7
  Top Layer w0.508: R7.1 21.34,9.99 CN3.2
LC1: length 4.6
  Top Layer w0.508: R11.1 26.54,10.05 28.96,7.63 CN4.2
LC2: length 5.8
  Top Layer w0.508: CN5.2 18.51,27.18 19.94,25.74 20.95,25.74 21.84,24.85 R19.1
LC3: length 6.2
  Top Layer w0.508: CN6.2 28.92,27.61 27.05,25.74 25.83,25.74 24.89,24.8 R15.1
$1N2374: length 2.3
  Top Layer w0.508: FF.2 34.31,10.78 R4.1
$1N2890: length 4.1
  Top Layer w0.508: U5.3 23.24,12.65 R8.2 R7.2
$1N2902: length 5.9
  Top Layer w0.305: U5.2 21.97,13.8 21.46,13.3 20.7,13.3 19.81,12.41 R5.2 19.79,12.27 R6.1
$1N3068: length 4.3
  Top Layer w0.508: R12.2 R11.2 25.78,13.03 U5.5
$1N3071: length 6.5
  Top Layer w0.305: R10.1 31.1,10.77 R9.2 29.59,12.41 28.83,13.17 27.43,13.17 27.05,13.55 U5.6
$1N3198: length 4.6
  Top Layer w0.508: 25.78,21.93 26.42,22.57 R16.2 ; 25.78,21.93 25.4,22.31 ; 25.78,21.93 U5.10
  Top Layer w0.7: R16.2 R15.2
$1N3201: length 4.8
  Top Layer w0.508: R14.1 27.96,22.58 R13.2 27.94,22.31 27.05,21.42 U5.9
$1N3455: length 3.9
  Top Layer w0.508: U5.12 23.24,22.45 R20.2 R19.2
$1N3458: length 5.2
  Top Layer w0.508: U5.13 21.97,20.93 R17.2 18.81,24.08 R18.1
$1N3772: length 2.3
  Top Layer w0.508: ON.1 10.71,11.8 R21.1

## Copper pours and planes (outline as drawn; the poured copper is in the pictures)
+5V on Top Layer: 13.08,17.23 14.45,17.23 14.45,13.47 13.08,13.47
+5V on Top Layer: 31.57,21.14 32.22,21.14 32.22,19.44 31.57,19.44
+5V on PWR: -3.05,43.65 53.21,43.65 53.21,-11.59 -3.05,-11.59
GND on Bottom Layer: -4.83,45.17 51.44,45.17 51.44,-10.07 -4.83,-10.07
GND on Gnd: 0.26,34.76 46.82,34.76 46.82,0.26 0.26,0.26

Small or netless copper shapes (teardrops, artwork), in the pictures only: 24 on Gnd

## Text on the board
Top Silkscreen Layer: DNP | JLCJLCJLCJLC | EXPO40 / PP-PCB V1.0 / Dirk Jan Bakels

# Board PCB1_1
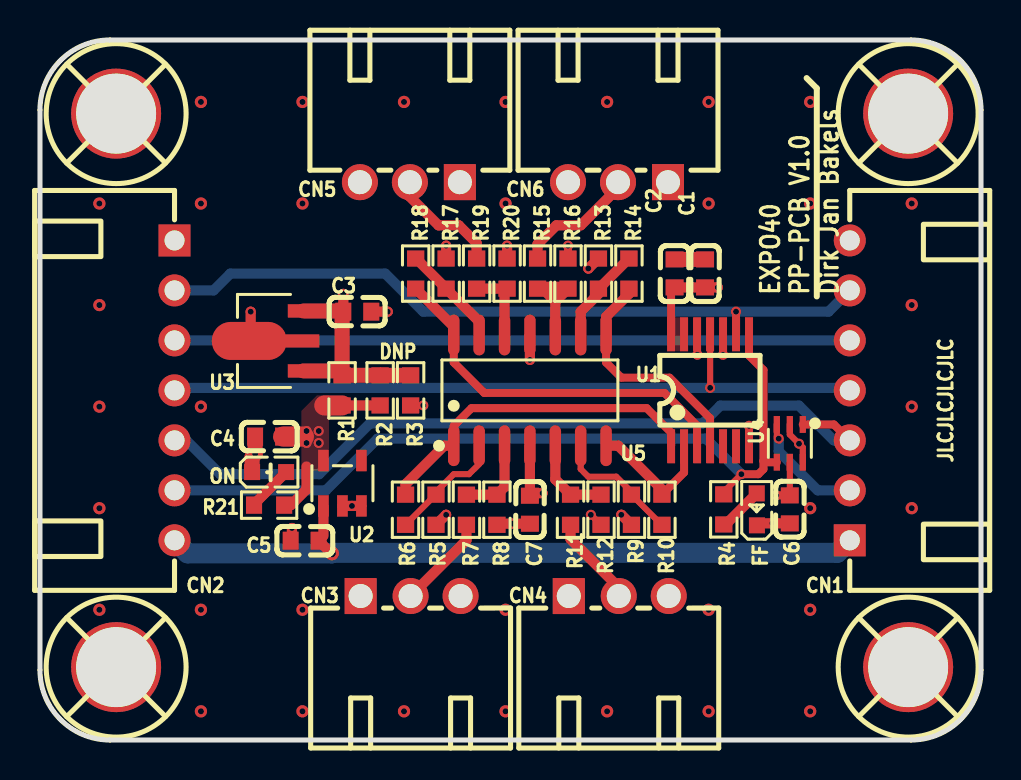
[diagram p4: board, top side]
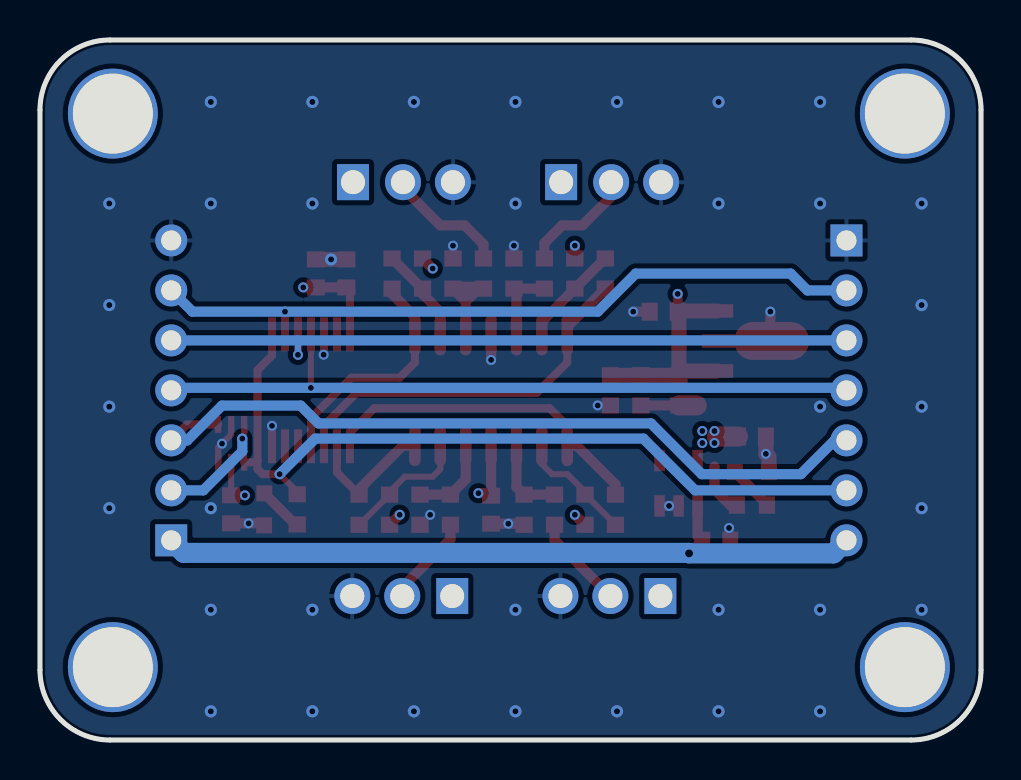
[diagram p5: board, bottom side, seen from below]

Outline 47.08 x 35.01 mm; copper layers: Top Layer, Gnd, PWR, Bottom Layer. Coordinates in mm from the lower left corner of the outline.
Outline path: 0,31.51 0,3.5 arc(1.03,1.03) 3.5,0 43.58,0 arc(46.05,1.03) 47.08,3.5 47.08,31.51 arc(46.05,33.99) 43.58,35.01 3.5,35.01 arc(1.03,33.99) 0,31.51
Stack: Top Layer 0.035mm Outer layer thickness 1oz / Dielectric1 0.2104mm 7628 RC49% 8.6mil / Gnd 0.0152mm Inner layer thickness / Dielectric2 1.065mm 1.1mm H/HOZ Copper / PWR 0.0152mm Inner layer thickness / Dielectric3 0.2104mm 7628 RC49% 8.6mil / Bottom Layer 0.035mm Outer layer thickness 1oz

## Design rules (mm)
template: JLCPCB Capability(Multiple Layers Board)
spacing copperThickness1oz (default): track to track 0.102, other pairs 0.152 to 0.3
spacing copperThickness2oz: track to track 0.203, other pairs 0.152 to 0.3
spacing copperThicknessInner0.5oz: track to track 0.089, other pairs 0.152 to 0.3
track width copperThickness1oz (default): min 0.102, default 0.254, max 2.54
track width copperThickness2oz: min 0.203, default 0.254, max 2.54
track width copperThickness0.5oz: min 0.089, default 0.254, max 2.54
differential pair differentialPair (default): width min 0.127, default 0.254, max 2.54; gap min 0.152, default 0.152
via viaSize (default): diameter min 0.3, default 0.61, max 10; hole min 0.2, default 0.305, max 6.3

## Placement (name value [footprint] x y rotation side)
C1  1uF  [C0603]  33.27 23.34 90 top
C2  100nF  [C0603]  31.75 23.34 90 top
C3  1uF  [C0603]  15.88 21.42 0 top
C4  470nF  [C0603]  11.46 15.18 180 top
C5  470nF  [C0603]  13.24 9.97 180 top
C6  100nF  [C0603]  37.51 11.54 270 top
C7  100nF  [C0603]  24.51 11.52 270 top
CN1  Master Side  [CONN-TH_7P-P2.50_DEALON_XH-W-7A]  40.51 17.49 90 top
CN2  Slave Side  [CONN-TH_7P-P2.50_DEALON_XH-W-7A]  6.73 17.49 270 top
CN3  XH-3AW  [CONN-TH_3P-P2.50_XH-3A]  18.54 7.2 0 top
CN4  XH-3AW  [CONN-TH_3P-P2.50_XH-3A]  28.96 7.2 0 top
CN5  XH-3AW  [CONN-TH_3P-P2.50_XH-3A]  18.5 27.9 180 top
CN6  XH-3AW  [CONN-TH_3P-P2.50_XH-3A]  28.92 27.9 180 top
FF  -  [LED0603-RD_GREEN]  35.86 11.54 90 top
ON  -  [LED0603-R-RD]  11.46 13.4 0 top
R1  330R  [R0603]  15.11 17.49 270 top
R2  1K-DNP  [R0603]  17.02 17.49 270 top
R3  1K-DNP  [R0603]  18.54 17.49 90 top
R4  330R  [R0603]  34.21 11.54 90 top
R5  10K  [R0603]  19.81 11.52 90 top
R6  4.7M  [R0603]  18.29 11.52 90 top
R7  10K  [R0603]  21.34 11.52 90 top
R8  4.7M  [R0603]  22.86 11.52 90 top
R9  10K  [R0603]  29.59 11.52 90 top
R10  4.7M  [R0603]  31.12 11.52 90 top
R11  10K  [R0603]  26.54 11.52 90 top
R12  4.7M  [R0603]  28.07 11.52 90 top
R13  10K  [R0603]  27.94 23.33 270 top
R14  4.7M  [R0603]  29.46 23.33 270 top
R15  10K  [R0603]  24.89 23.33 270 top
R16  4.7M  [R0603]  26.42 23.33 270 top
R17  10K  [R0603]  20.32 23.33 270 top
R18  4.7M  [R0603]  18.8 23.33 270 top
R19  10K  [R0603]  21.84 23.33 270 top
R20  4.7M  [R0603]  23.37 23.33 270 top
R21  330R  [R0603]  11.46 11.75 0 top
SCREW1  -  [Screw-Hole-M4]  43.43 3.64 0 top
SCREW2  -  [Screw-Hole-M4]  3.81 3.64 0 top
SCREW3  -  [Screw-Hole-M4]  3.81 31.33 0 top
SCREW4  -  [Screw-Hole-M4]  43.43 31.33 0 top
U1  MCP3204-CI/SL  [TSSOP-14_L5.0-W4.4-P0.65-LS6.4-BL]  33.52 17.49 0 top
U2  TCR1HF50B,LM(CT  [SOT-25-5_L2.9-W1.6-P0.95-LS2.8-BR]  15.13 12.84 270 top
U3  AZ431AR  [SOT-89-3_L4.5-W2.5-P1.50-LS4.2-BR]  11.83 19.96 0 top
U4  NC7SZ374P6X  [SC-70-6_L2.2-W1.3-P0.65-LS2.2-BR]  37.51 14.84 90 top
U5  TLV9004IDR  [SOIC-14_L8.7-W3.9-P1.27-LS6.0-BL]  24.51 17.49 0 top

## Footprints (pads in the part's own frame, mm; a bottom-side part is the same pattern mirrored in y, then rotated)
C0603
  rect 0.8x0.9 smd: 1(-0.7,0) 2(0.7,0)
CONN-TH_3P-P2.50_XH-3A
  rect 1.6x1.8 hole 1.2: 1(-2.5,0)
  round 1.8 hole 1.2: 2(0,0) 3(2.5,0)
CONN-TH_7P-P2.50_DEALON_XH-W-7A
  rect 1.6x1.6 hole 1: 1(-7.5,0)
  round 1.6 hole 1: 2(-5,0) 3(-2.5,0) 4(0,0) 5(2.5,0) 6(5,0) 7(7.5,0)
LED0603-R-RD
  rect 0.8x0.8 smd: 1(0.851,0) 2(-0.851,0)
LED0603-RD_GREEN
  rect 0.8x0.8 smd: 1(-0.799,-0.004) 2(0.799,0.004)
R0603
  rect 0.806x0.864 smd: 1(-0.753,0) 2(0.753,0)
SC-70-6_L2.2-W1.3-P0.65-LS2.2-BR
  rect 0.841x0.315 smd: 1(0.946,-0.65) 2(0.946,0) 3(0.946,0.65) 4(-0.946,0.65) 5(-0.946,0) 6(-0.946,-0.65)
Screw-Hole-M4
  round 4.5 hole 4: 1(0,0)
SOIC-14_L8.7-W3.9-P1.27-LS6.0-BL
  oval 0.574x2.038 smd: 1(-3.81,-2.769) 2(-2.54,-2.769) 3(-1.27,-2.769) 4(0,-2.769) 5(1.27,-2.769) 6(2.54,-2.769) 7(3.81,-2.769) 8(3.81,2.769) 9(2.54,2.769) 10(1.27,2.769) 11(0,2.769) 12(-1.27,2.769) 13(-2.54,2.769) 14(-3.81,2.769)
SOT-25-5_L2.9-W1.6-P0.95-LS2.8-BR
  rect 1.07x0.532 smd: 1(1.135,-0.95) 2(1.135,0) 3(1.135,0.95) 4(-1.135,0.95) 5(-1.135,-0.95)
SOT-89-3_L4.5-W2.5-P1.50-LS4.2-BR
  rect 1.575x0.672 smd: 1(1.356,-1.5) 3(1.356,1.5)
  custom 5.377x1.9 smd: 2(-1.356,0)
TSSOP-14_L5.0-W4.4-P0.65-LS6.4-BL
  rect 0.4x1.7 smd: 1(-1.95,-2.8) 2(-1.3,-2.8) 3(-0.65,-2.8) 4(0,-2.8) 5(0.65,-2.8) 6(1.3,-2.8) 7(1.95,-2.8) 8(1.95,2.8) 9(1.3,2.8) 10(0.65,2.8) 11(0,2.8) 12(-0.65,2.8) 13(-1.3,2.8) 14(-1.95,2.8)

## Nets
As in the schematic.

Pads without a net: SCREW1 1; SCREW2 1; SCREW3 1; SCREW4 1; U1 5 6; U2 4

## Via types
v1: diameter 0.5, hole 0.3, Top Layer to Bottom Layer, 32 vias
v2: diameter 0.61, hole 0.305, Top Layer to Bottom Layer, 36 vias
v3: diameter 0.7, hole 0.4, Top Layer to Bottom Layer, 1 via

## Routing (per net, layer and track width the routed paths; a pad name or vN(x,y) marks a point on that pad's centre or on a via; arc(x,y) is an arc through that point)
2.5V_REF: length 52.7
  Top Layer w0.508: R5.1 20.31,11.27 v1(20.32,11.27) ; v1(29.08,11.27) 29.09,11.27 R9.1 ; R13.1 27.44,23.58 v1(27.43,23.58) ; C3.1 v1(15.17,22.31) ; v1(20.32,24.73) R17.1
  Top Layer w0.75: R3.2 R2.1 R1.1 ; R1.1 14.89,18.46 U3.1 ; R1.1 15.11,21.36 C3.1 15.14,21.46 U3.3
  PWR w0.508: v1(27.43,23.58) 21.46,23.58 v1(20.32,24.73) 17.59,24.73 v1(15.17,22.31) 15.17,14.63 18.54,11.27 v1(20.32,11.27) 22.35,13.3 27.05,13.3 v1(29.08,11.27)
+5V: length 16.5
  Top Layer w0.305: U4.5 C6.1
  Top Layer w0.4: U1.14 31.57,22.46 C2.1 ; C6.1 v1(36.83,12.24)
  Top Layer w0.508: U5.4 C7.1 24.64,12.35 v1(25.15,12.35) ; C2.1 C1.1 v1(33.91,22.64) ; R21.2 12.55,11.75 13.34,12.53 13.34,13.68 ; R1.2 R2.2
  Top Layer w1.001: R1.2 14.22,16.73 ; C4.1 13.21,15.18
  vias: v1(13.34,15.46) v1(13.34,14.86) v1(13.94,15.46) v1(13.94,14.86)
GND: length 18.7
  Top Layer w0.305: U4.6 38.16,14.63 v1(37.97,14.82) 37.51,15.28 U4.2 ; U1.12 32.87,19.29 v1(32.89,19.27) ; v1(27.56,11.27) 27.57,11.27 R12.1 ; U1.7 v1(35.47,15.72) ; R3.1 v1(19.18,16.73)
  Top Layer w0.4: R16.1 v1(26.42,24.73)
  Top Layer w0.508: C5.2 12.61,10.04 v1(12.61,10.61) ; U5.11 v1(24.51,19.01) ; C7.2 v1(23.65,10.82) 22.91,10.82 R8.1 ; C6.2 v1(36.64,10.84) 35.97,10.84 FF.1 ; U2.3 v1(15.61,11.71) U2.2 ; U3.2 10.54,20.03 v1(10.54,21.42) ; C3.2 v1(17.4,21.42) ; R20.1 v1(23.37,24.73)
  Top Layer w0.75: C1.2 v2(32.52,24.04) C2.2 ; ON.2 10.61,14.16 v1(10.76,14.31) C4.2
  vias: v2(2.97,26.83) v2(2.97,21.75) v2(2.97,16.67) v2(2.97,11.59) v2(2.97,6.52) v2(8.05,31.91) v2(8.05,26.83) v2(8.05,16.67) v2(8.05,6.52) v2(8.05,1.43) v2(13.13,31.91) v2(13.13,26.83) v2(13.13,6.52) v2(13.13,1.43) v2(18.21,31.91) v2(18.21,1.43) v2(23.29,31.91) v2(23.29,26.83) v2(23.29,6.52) v2(23.29,1.43) v2(28.37,31.91) v2(28.37,1.43) v2(33.45,31.91) v2(33.45,26.83) v2(33.45,6.52) v2(33.45,1.43) v2(38.53,31.91) v2(38.53,26.83) v2(38.53,11.59) v2(38.53,6.52) v2(38.53,1.43) v2(43.61,26.83) v2(43.61,21.75) v2(43.61,16.67) v2(43.61,11.59)
VCC: length 36.7
  Top Layer w0.508: U2.1 14.18,10.21 ; C5.1 14.58,9.34 v3(14.6,9.34)
  Bottom Layer w1.001: CN1.1 39.88,9.36 14.63,9.36 v3(14.6,9.34) 7.38,9.34 CN2.7
ADC0: length 17.2
  Top Layer w0.4: U1.1 31.57,15.38 30.35,16.6 21.59,16.6 20.7,15.71 U5.1
  Top Layer w0.508: R6.2 18.29,12.79 20.22,14.72 U5.1
ADC1: length 6.8
  Top Layer w0.4: R10.2 32.22,13.38 U1.2
  Top Layer w0.508: U5.7 28.93,14.72 31.12,12.53 R10.2
ADC2: length 19
  Top Layer w0.4: U1.3 32.87,15.73 31.24,17.36 22.22,17.36 20.7,18.88 U5.14
  Top Layer w0.508: R18.2 20.7,20.67 U5.14
ADC3: length 11.9
  Top Layer w0.4: U5.8 28.32,18.88 29.08,18.12 31.5,18.12 33.52,16.1 U1.4
  Top Layer w0.508: R14.2 29.46,22.31 28.32,21.17 U5.8
ADC_MISO: length 35.5
  Top Layer w0.4: U1.10 v1(34.17,19.27)
  Bottom Layer w0.305: v1(34.17,19.27) 34.17,19.98 34.18,19.99
  Bottom Layer w0.508: CN1.5 CN2.3
ADC_MOSI: length 36.5
  Top Layer w0.4: 34.82,20.29 v1(34.82,21.42)
  Bottom Layer w0.508: CN1.6 39.45,21.42 v1(34.82,21.42) 19.18,21.42 17.27,23.33 9.53,23.33 8.68,22.49 CN2.2
ADC_SCK: length 36.6
  Top Layer w0.305: U1.11 33.53,20.29 v1(33.53,17.61)
  Bottom Layer w0.508: CN2.4 6.86,17.61 v1(33.53,17.61) 40.39,17.61 CN1.4
FF_CLK: length 39.3
  Top Layer w0.4: U4.1 39.72,15.78 CN1.3
  Bottom Layer w0.508: CN1.3 39.71,14.99 37.97,16.73 34.04,16.73 33.15,15.84 16.51,15.84 13.97,13.3 9.02,13.3 7.33,14.99 CN2.5
FF_DIN: length 5.7
  Top Layer w0.305: v1(36.96,15.07) 36.86,15.17 U4.3
  Bottom Layer w0.508: CN1.2 38.91,12.49 36.96,14.44 v1(36.96,15.07)
FF_DOUT: length 40.5
  Top Layer w0.305: v1(35.09,13.3) 34.21,12.42 34.21,12.29
  Top Layer w0.4: 36.19,13.95 36.19,13.55 35.94,13.3 v1(35.09,13.3) ; 36.19,13.95 36.19,18.5 35.47,19.23 U1.8 ; 36.19,13.95 36.25,13.89 U4.4
  Bottom Layer w0.508: CN2.6 14.3,12.49 16.89,15.07 33.31,15.07 v1(35.09,13.3)
LC0: length 4.7
  Top Layer w0.508: R7.1 21.34,9.99 CN3.2
LC1: length 4.6
  Top Layer w0.508: R11.1 26.54,10.05 28.96,7.63 CN4.2
LC2: length 5.8
  Top Layer w0.508: CN5.2 18.51,27.18 19.94,25.74 20.95,25.74 21.84,24.85 R19.1
LC3: length 6.2
  Top Layer w0.508: R15.1 24.89,24.8 25.83,25.74 27.05,25.74 28.92,27.61 CN6.2
$1N2374: length 2.3
  Top Layer w0.508: R4.1 34.31,10.78 FF.2
$1N2890: length 4.1
  Top Layer w0.508: R7.2 R8.2 23.24,12.65 U5.3
$1N2902: length 5.9
  Top Layer w0.305: R6.1 19.79,12.27 R5.2 19.81,12.41 20.7,13.3 21.46,13.3 21.97,13.8 U5.2
$1N3068: length 4.3
  Top Layer w0.508: U5.5 25.78,13.03 R11.2 R12.2
$1N3071: length 6.5
  Top Layer w0.305: U5.6 27.05,13.55 27.43,13.17 28.83,13.17 29.59,12.41 R9.2 31.1,10.77 R10.1
$1N3198: length 4.6
  Top Layer w0.508: 25.78,21.93 25.4,22.31 ; 25.78,21.93 26.42,22.57 R16.2 ; 25.78,21.93 U5.10
  Top Layer w0.7: R16.2 R15.2
$1N3201: length 4.8
  Top Layer w0.508: U5.9 27.05,21.42 27.94,22.31 R13.2 27.96,22.58 R14.1
$1N3455: length 3.9
  Top Layer w0.508: R19.2 R20.2 23.24,22.45 U5.12
$1N3458: length 5.2
  Top Layer w0.508: R18.1 18.81,24.08 R17.2 21.97,20.93 U5.13
$1N3772: length 2.3
  Top Layer w0.508: R21.1 10.71,11.8 ON.1

## Copper pours and planes (outline as drawn; the poured copper is in the pictures)
+5V on Top Layer: 13.08,17.23 14.45,17.23 14.45,13.47 13.08,13.47
+5V on Top Layer: 31.57,21.14 32.22,21.14 32.22,19.44 31.57,19.44
+5V on PWR: -3.05,43.65 53.21,43.65 53.21,-11.59 -3.05,-11.59
GND on Bottom Layer: -4.83,45.17 51.44,45.17 51.44,-10.07 -4.83,-10.07
GND on Gnd: 0.26,34.76 46.82,34.76 46.82,0.26 0.26,0.26

Small or netless copper shapes (teardrops, artwork), in the pictures only: 24 on Gnd

## Text on the board
Top Silkscreen Layer: DNP | JLCJLCJLCJLC | EXPO40 / PP-PCB V1.0 / Dirk Jan Bakels
